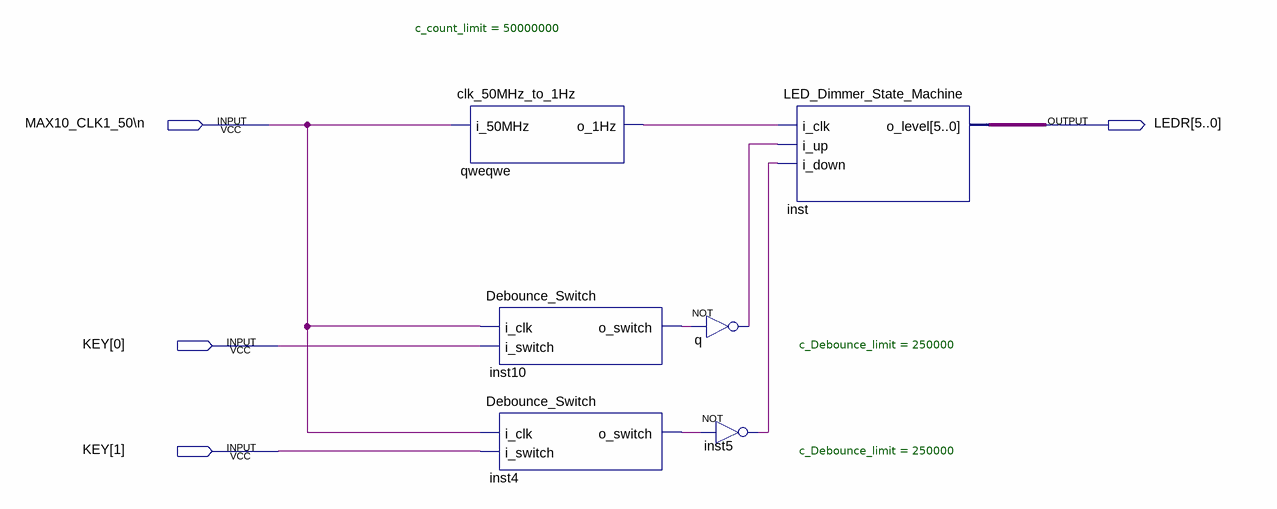
[diagram p0: schematic sheet]
// Quartus schematic LED_Dimmer.bdf as structural Verilog: 6 symbols, 4 pins
module LED_Dimmer (
  input  \MAX10_CLK1_50\n ,
  input  [1:0] KEY,
  output [5:0] LEDR
);

  wire inst4_o_switch, inst5_out, inst10_o_switch, q_out, qweqwe_o_1hz;

  clk_50MHz_to_1Hz #(.c_count_limit(50000000)) qweqwe (.i_50MHz(\MAX10_CLK1_50\n ), .o_1Hz(qweqwe_o_1hz));
  Debounce_Switch #(.c_Debounce_limit(250000)) inst10 (
    .i_clk(\MAX10_CLK1_50\n ), .i_switch(KEY[0]), .o_switch(inst10_o_switch));
  Debounce_Switch #(.c_Debounce_limit(250000)) inst4 (
    .i_clk(\MAX10_CLK1_50\n ), .i_switch(KEY[1]), .o_switch(inst4_o_switch));
  not q (q_out, inst10_o_switch);
  not inst5 (inst5_out, inst4_o_switch);
  LED_Dimmer_State_Machine inst (.i_clk(qweqwe_o_1hz), .i_up(q_out), .i_down(inst5_out), .o_level(LEDR));
endmodule
